# EAGLE design epoch_revA (EAGLE 9.5.2)

## Sheet 1 of 3
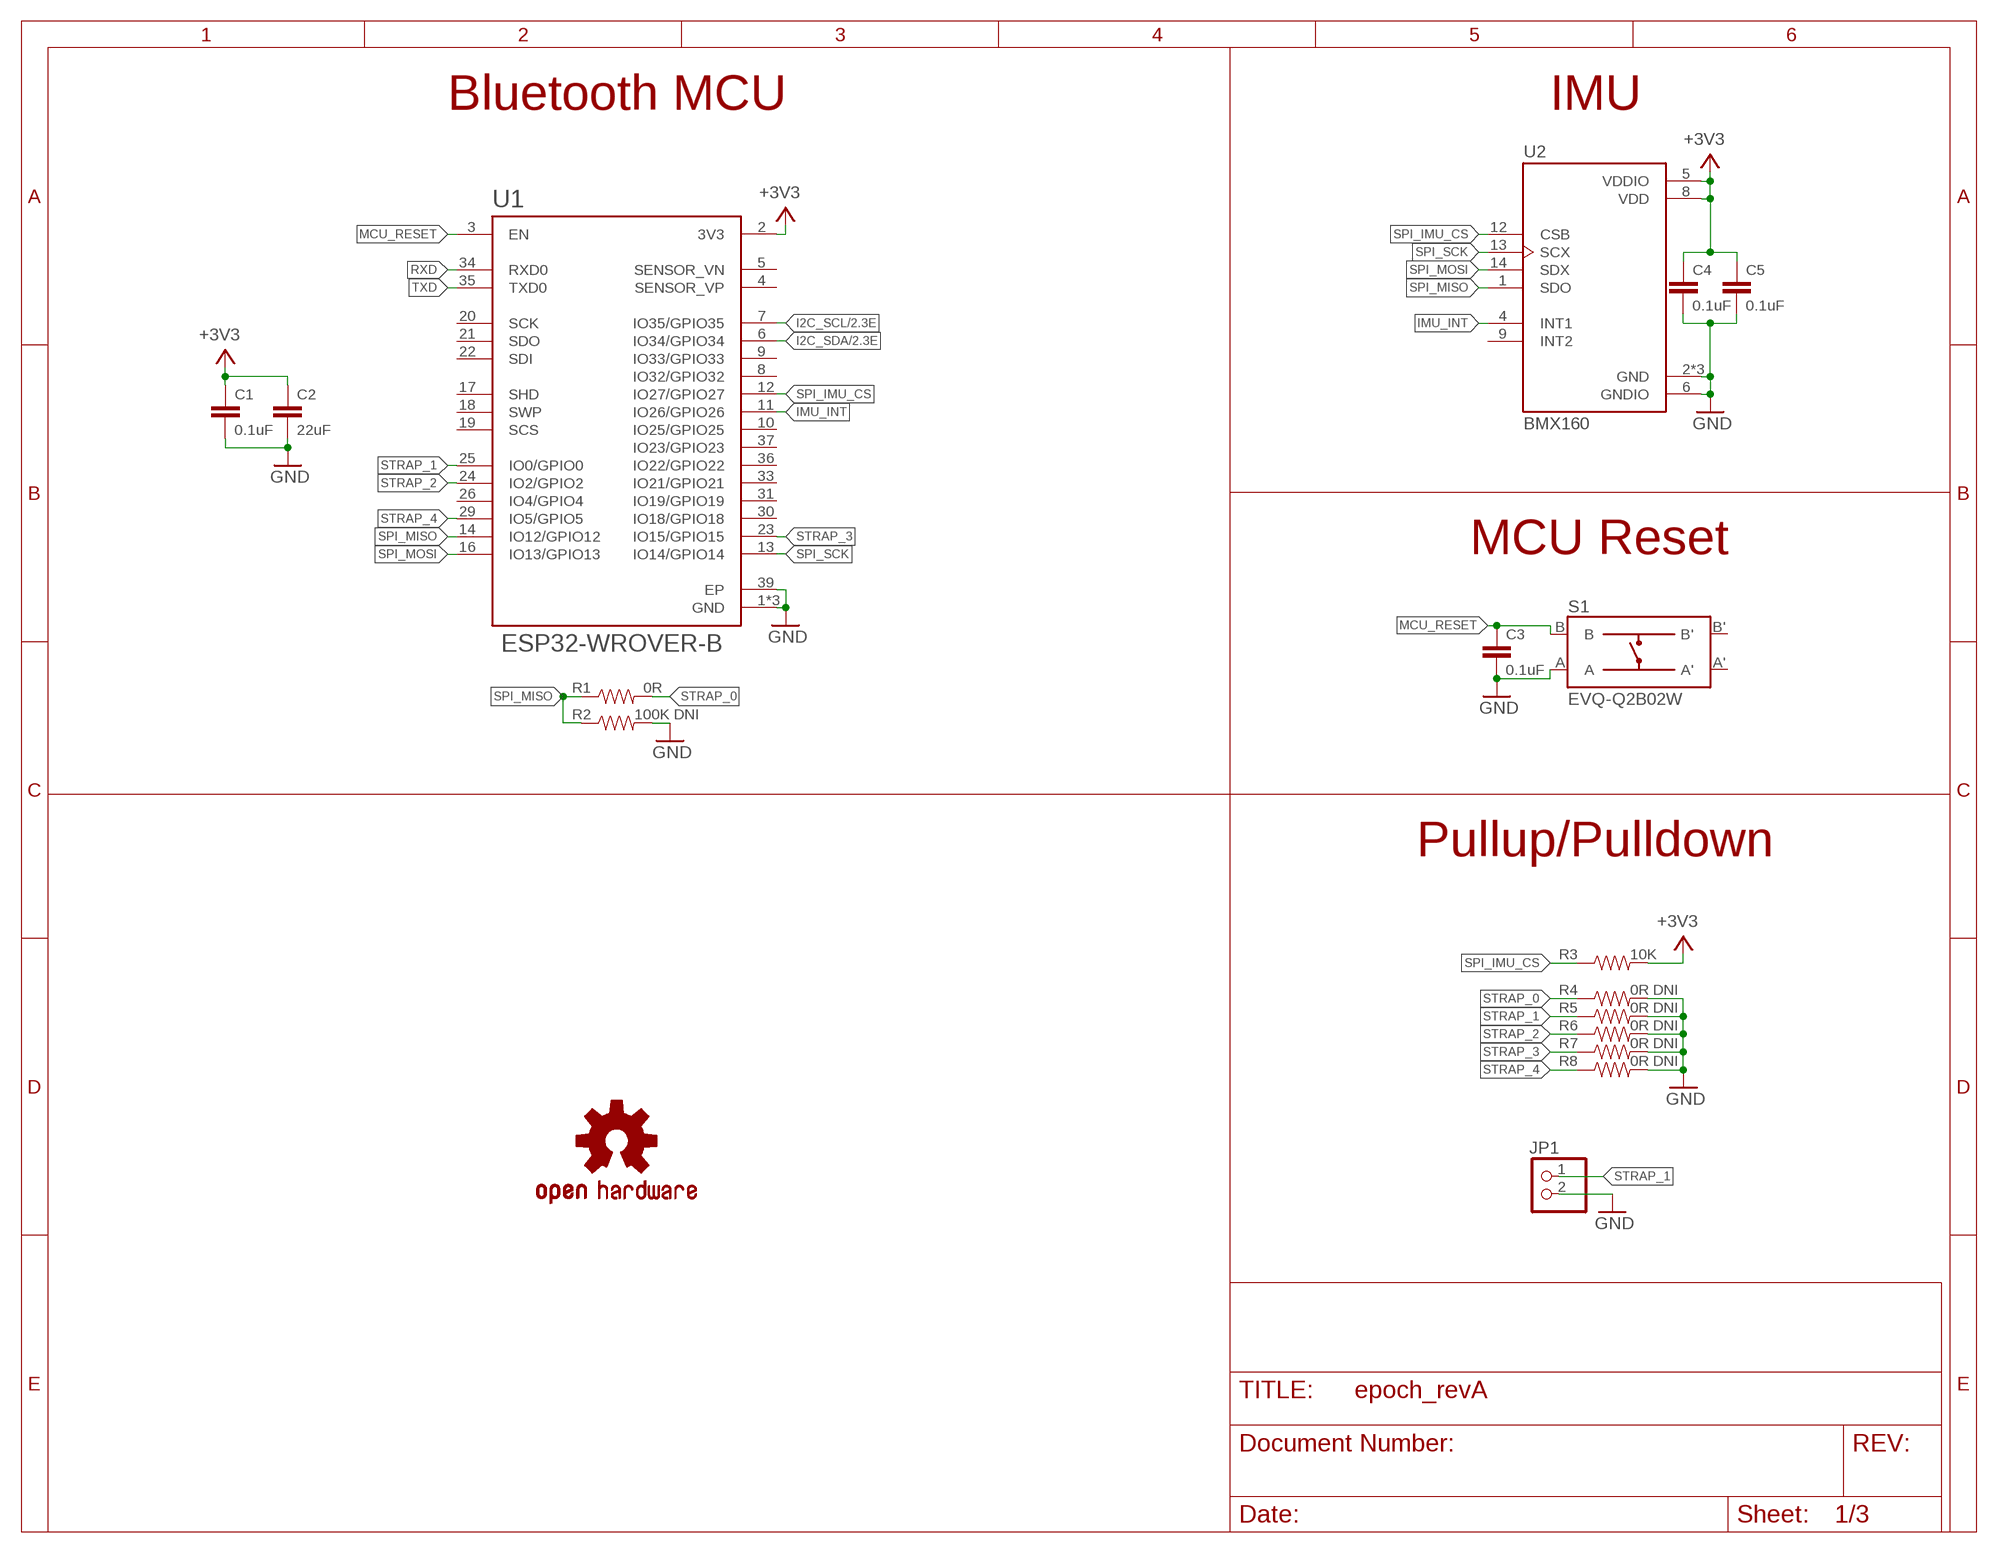
[diagram p0: schematic, sheet 1]

### Parts
C1  0.1uF  CAP_0603  [0603]
C2  22uF  CAP_0603  [0603]
C3  0.1uF  CAP_0603  [0603]
C4  0.1uF  CAP_0603  [0603]
C5  0.1uF  CAP_0603  [0603]
JP1  PINHD-1X2  [1X02]
LOGO1  OSHW-LOGOMINI  [OSHW-LOGO-MINI]
R1  0R  RES_0603  [0603]
R2  100K DNI  RES_0603  [0603]
R3  10K  RES_0603  [0603]
R4  0R DNI  RES_0603  [0603]
R5  0R DNI  RES_0603  [0603]
R6  0R DNI  RES_0603  [0603]
R7  0R DNI  RES_0603  [0603]
R8  0R DNI  RES_0603  [0603]
S1  EVQ-Q2B02W  [SW_EVQ-Q2B02W]
U1  ESP32-WROVER-B  ESP32-WROVER-B_(16MB)  [XCVR_ESP32-WROVER-B_(16MB)]
U2  BMX160  [PQFN50P250X300X100-14N]

### Nets
+3V3: C1.1 C2.1 C4.1 C5.1 R3.2 U1.2(3V3) U2.5(VDDIO) U2.8(VDD) ; also sheet 2,3
GND: C1.2 C2.2 C3.2 C4.2 C5.2 JP1.2 R2.2 R4.2 R5.2 R6.2 R7.2 R8.2 S1.A U1.1(GND) U1.15(GND) U1.38(GND) U1.39(EP) U2.2(GND) U2.3(GND) U2.6(GNDIO) U2.7(GND) ; also sheet 2,3
I2C_SCL: U1.7(IO35/GPIO35) ; also sheet 2
I2C_SDA: U1.6(IO34/GPIO34) ; also sheet 2
IMU_INT: U1.11(IO26/GPIO26) U2.4(INT1)
MCU_RESET: C3.1 S1.B U1.3(EN)
RXD: U1.34(RXD0)
SPI_IMU_CS: R3.1 U1.12(IO27/GPIO27) U2.12(CSB)
SPI_MISO: R1.1 R2.1 U1.14(IO12/GPIO12) U2.1(SDO)
SPI_MOSI: U1.16(IO13/GPIO13) U2.14(SDX)
SPI_SCK: U1.13(IO14/GPIO14) U2.13(SCX)
STRAP_0: R1.2 R4.1
STRAP_1: JP1.1 R5.1 U1.25(IO0/GPIO0)
STRAP_2: R6.1 U1.24(IO2/GPIO2)
STRAP_3: R7.1 U1.23(IO15/GPIO15)
STRAP_4: R8.1 U1.29(IO5/GPIO5)
TXD: U1.35(TXD0)
Unconnected: S1.A' S1.B' U1.4(SENSOR_VP) U1.5(SENSOR_VN) U1.8(IO32/GPIO32) U1.9(IO33/GPIO33) U1.10(IO25/GPIO25) U1.17(SHD) U1.18(SWP) U1.19(SCS) U1.20(SCK) U1.21(SDO) U1.22(SDI) U1.26(IO4/GPIO4) U1.30(IO18/GPIO18) U1.31(IO19/GPIO19) U1.33(IO21/GPIO21) U1.36(IO22/GPIO22) U1.37(IO23/GPIO23) U2.9(INT2)

### Notes on the sheet
- Bluetooth MCU | IMU
- MCU Reset
- Pullup/Pulldown

## Sheet 2 of 3
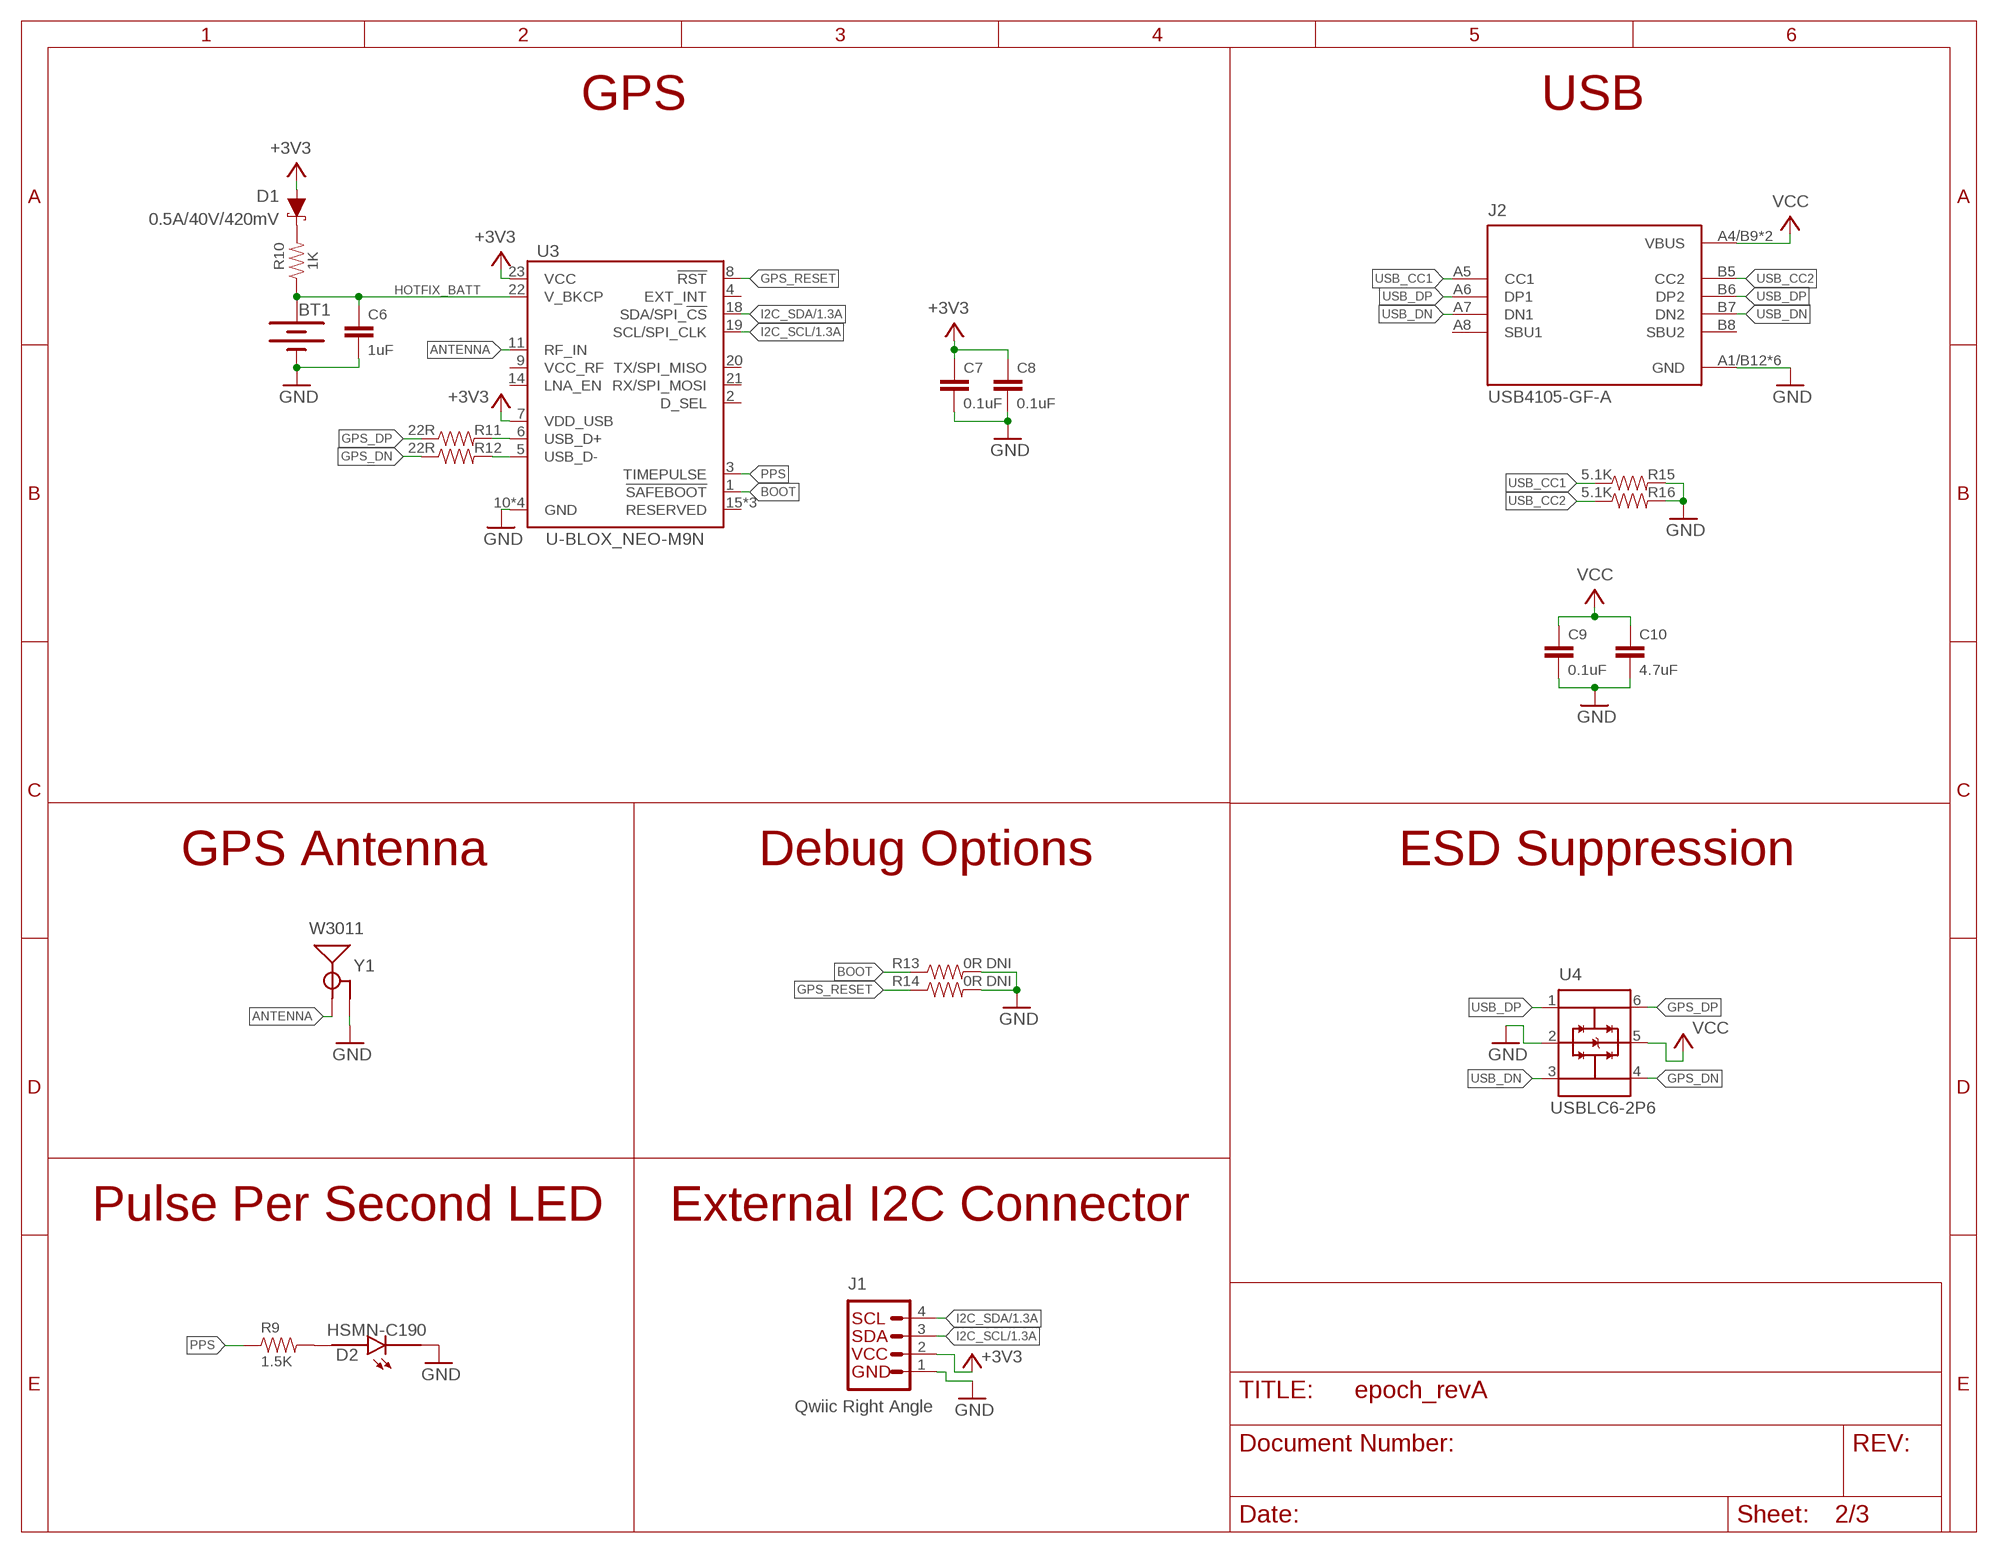
[diagram p1: schematic, sheet 2]

### Parts
BT1  ML414H-IV01E  ML414H_IV01E_BATTERY  [ML414H_IV01E]
C6  1uF  CAP_0603  [0603]
C7  0.1uF  CAP_0603  [0603]
C8  0.1uF  CAP_0603  [0603]
C9  0.1uF  CAP_0603  [0603]
C10  4.7uF  CAP_0603  [0603]
D1  0.5A/40V/420mV  DIODE-SCHOTTKY-PMEG4005EJ  [SOD-323]
D2  HSMN-C190  [LEDM1608X80]
J1  Qwiic Right Angle  I2C_STANDARDQWIIC  [1X04_1MM_RA]
J2  USB4105-GF-A  [GCT_USB4105-GF-A]
R9  1.5K  RES_0603  [0603]
R10  1K  RES_0603  [0603]
R11  22R  RES_0603  [0603]
R12  22R  RES_0603  [0603]
R13  0R DNI  RES_0603  [0603]
R14  0R DNI  RES_0603  [0603]
R15  5.1K  RES_0603  [0603]
R16  5.1K  RES_0603  [0603]
U3  U-BLOX_NEO-M9N  [NEO-M9N]
U4  USBLC6-2P6  [SOT50P160X60-6N]
Y1  W3011  GPS_CHIP_ANTENNAW3011  [W3011]

### Nets
+3V3: C7.1 C8.1 D1.A J1.2 U3.7(VDD_USB) U3.23(VCC) ; also sheet 1,3
ANTENNA: U3.11(RF_IN) Y1.1(SIGNAL)
BOOT: R13.1 U3.1(!SAFEBOOT!)
DN: R12.2 U3.5(USB_D-)
DP: R11.2 U3.6(USB_D+)
GND: BT1.- C6.2 C7.2 C8.2 C9.2 C10.2 D2.C J1.1 J2.A1/B12(GND) J2.B1/A12(GND) J2.G1(GND) J2.G2(GND) J2.G3(GND) J2.G4(GND) R13.2 R14.2 R15.2 R16.2 U3.10(GND) U3.12(GND) U3.13(GND) U3.24(GND) U4.2(GND) Y1.2(GND) Y1.3(GND) ; also sheet 1,3
GPS_DN: R12.1 U4.4(I/O2_2)
GPS_DP: R11.1 U4.6(I/O1_2)
GPS_RESET: R14.1 U3.8(!RST)
HOTFIX_BATT: BT1.+ C6.1 R10.1 U3.22(V_BKCP)
I2C_SCL: J1.3 U3.19(SCL/SPI_CLK) ; also sheet 1
I2C_SDA: J1.4 U3.18(SDA/SPI_!CS!) ; also sheet 1
N$1: D1.C R10.2
N$4: D2.A R9.2
PPS: R9.1 U3.3(TIMEPULSE)
USB_CC1: J2.A5(CC1) R15.1
USB_CC2: J2.B5(CC2) R16.1
USB_DN: J2.A7(DN1) J2.B7(DN2) U4.3(I/O2_1)
USB_DP: J2.A6(DP1) J2.B6(DP2) U4.1(I/O1_1)
VCC: C9.1 C10.1 J2.A4/B9(VBUS) J2.B4/A9(VBUS) U4.5(VBUS) ; also sheet 3
Unconnected: J2.A8(SBU1) J2.B8(SBU2) U3.2(D_SEL) U3.4(EXT_INT) U3.9(VCC_RF) U3.14(LNA_EN) U3.15(RESERVED) U3.16(RESERVED) U3.17(RESERVED) U3.20(TX/SPI_MISO) U3.21(RX/SPI_MOSI)

### Notes on the sheet
- GPS | USB
- GPS Antenna | Debug Options | ESD Suppression
- Pulse Per Second LED | External I2C Connector

## Sheet 3 of 3
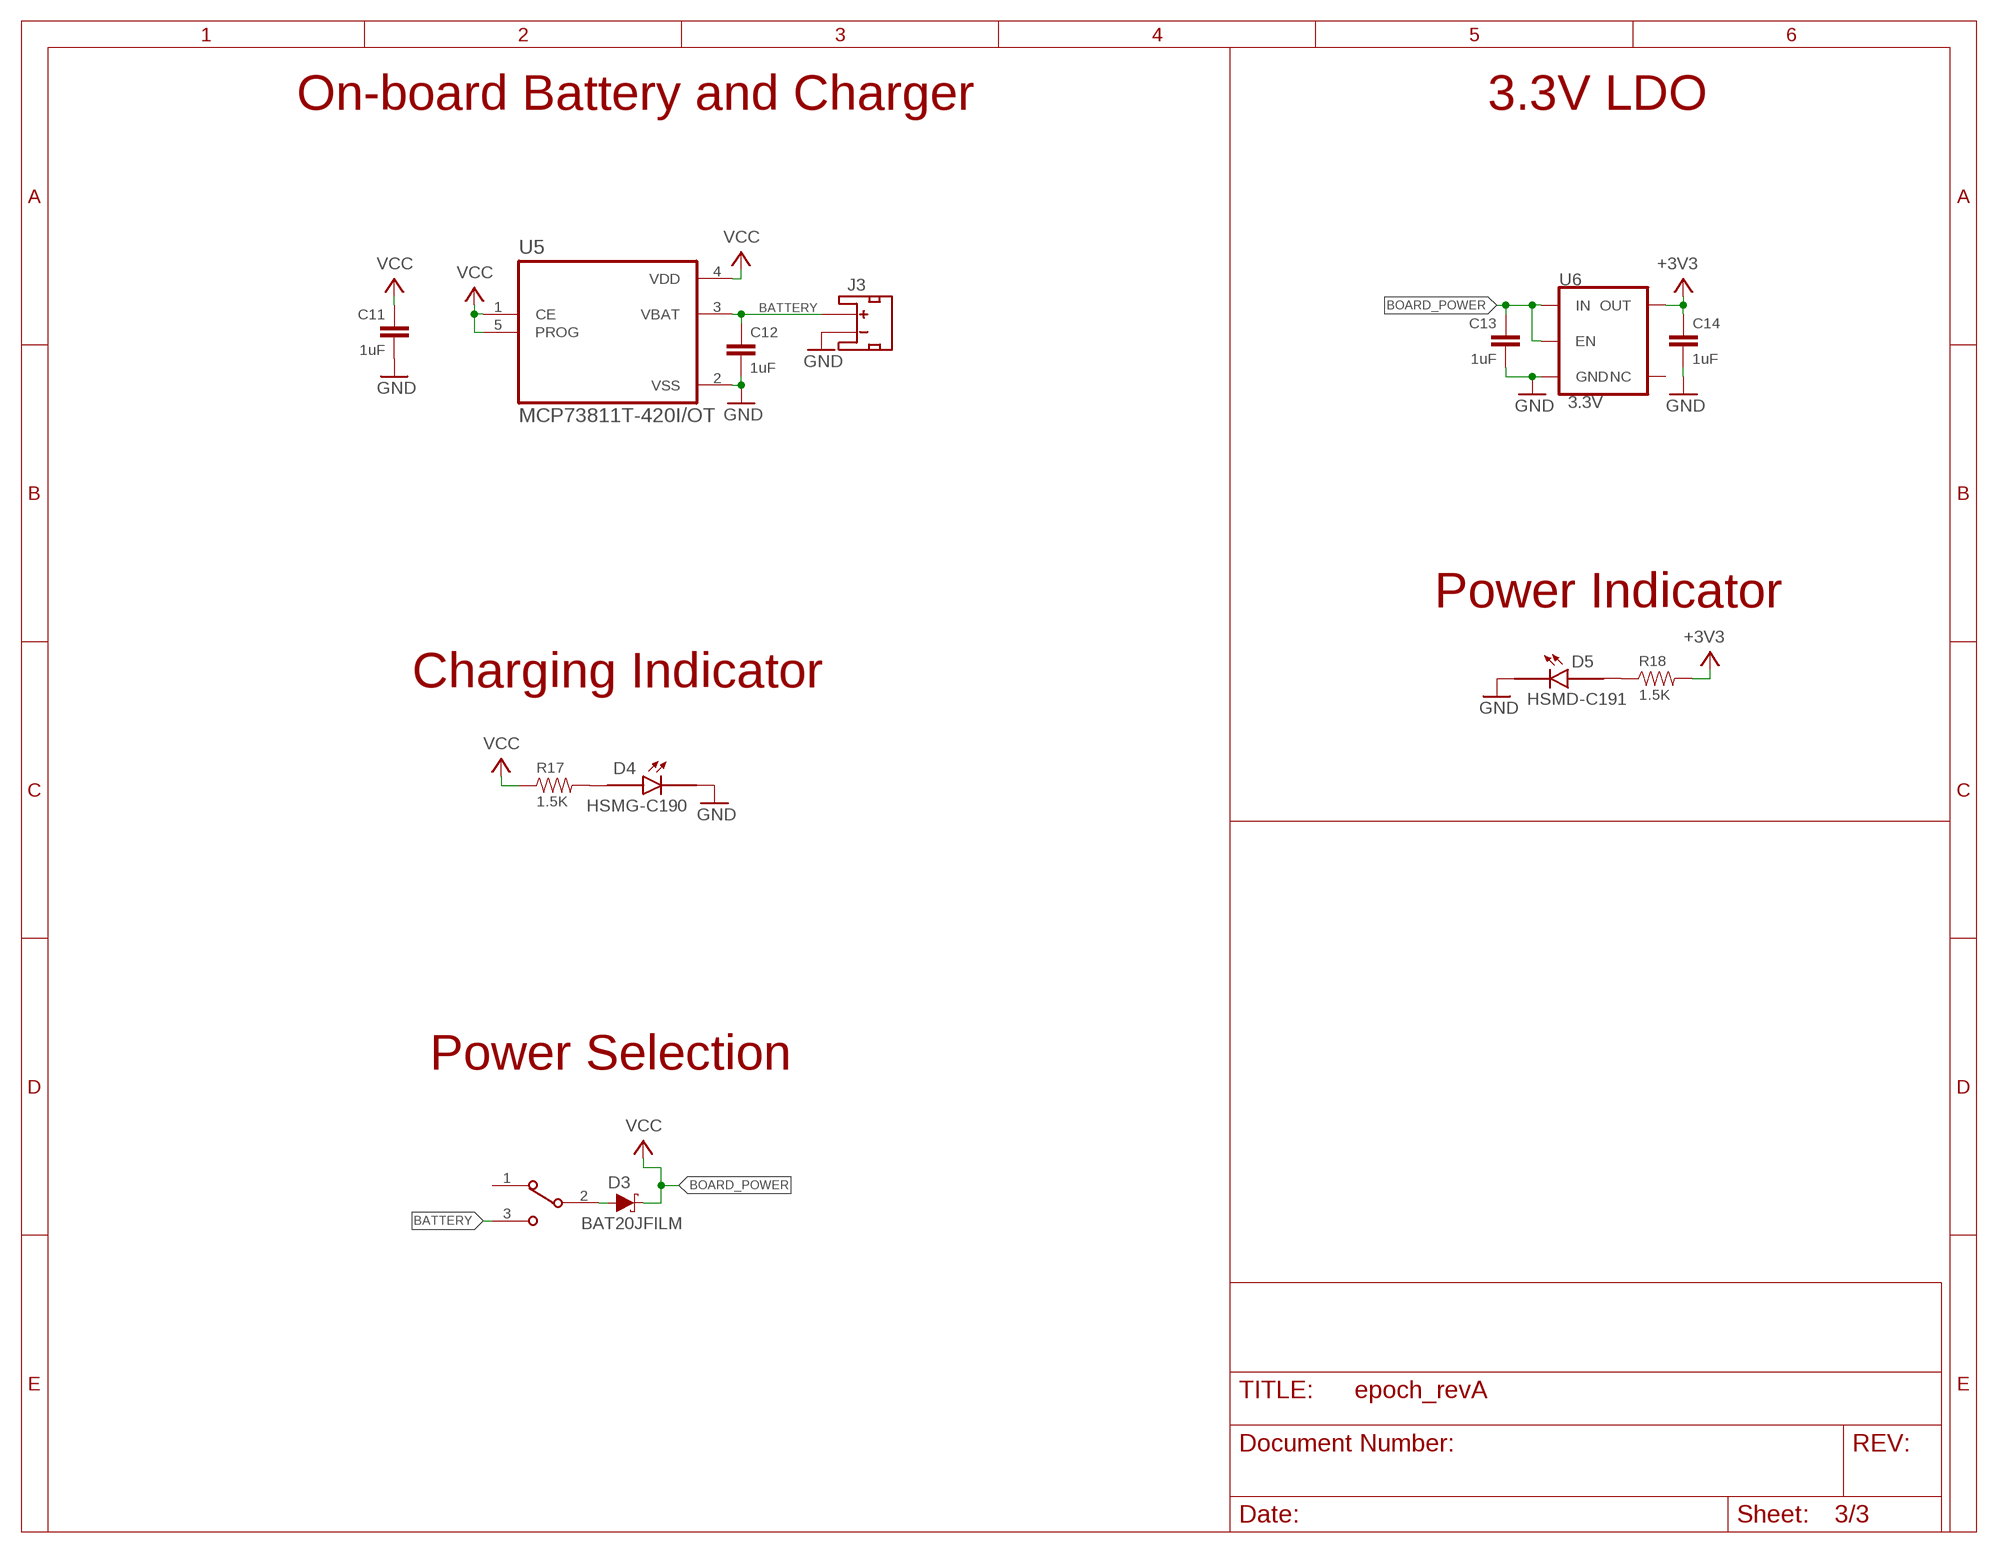
[diagram p2: schematic, sheet 3]

### Parts
C11  1uF  CAP_0603  [0603]
C12  1uF  CAP_0603  [0603]
C13  1uF  CAP_0603  [0603]
C14  1uF  CAP_0603  [0603]
D3  BAT20JFILM  DIODE-SCHOTTKY-BAT20J  [SOD-323]
D4  HSMG-C190  [LEDM1608X80]
D5  HSMD-C191  [LEDM1608X80]
J3  JST_2MM_MALE  [JST-2-SMD]
R17  1.5K  RES_0603  [0603]
R18  1.5K  RES_0603  [0603]
S2  EG1213  [SW_EG1213]
U5  MCP73811T-420I/OT  [SOT95P280X145-5N]
U6  3.3V  V_REG_AP2112K-3.3V  [SOT23-5]

### Nets
+3V3: C14.1 R18.2 U6.5(OUT) ; also sheet 1,2
BATTERY: C12.1 J3.2(+) S2.3 U5.3(VBAT)
BOARD_POWER: C13.1 D3.C U6.1(IN) U6.3(EN) ; supply symbol labelled VCC
GND: C11.2 C12.2 C13.2 C14.2 D4.C D5.C J3.1(-) U5.2(VSS) U6.2(GND) ; also sheet 1,2
N$5: D5.A R18.1
N$6: D4.A R17.2
N$7: D3.A S2.2
VCC: C11.1 R17.1 U5.1(CE) U5.4(VDD) U5.5(PROG) ; also sheet 2
Unconnected: J3.NC1(PAD1) J3.NC2(PAD2) S2.1 U6.4(NC)

### Notes on the sheet
- On-board Battery and Charger | 3.3V LDO
- Power Indicator
- Charging Indicator
- Power Selection

## Library data of the parts
BT1 = SparkFun-Batteries:ML414H_IV01E_BATTERY: SEIKO ML414H-IV01E Reflowable Lithium Battery ML414H is a rechargeable, coin type battery with features such as Pb-free reflowable (Peak temperature: 260 C) and high temperature heat resistance. Battery Characteristics: 3.1V max voltage Voff is 2V 1mAH 3k series resistor with battery 72 hour charge time from 2.0-3.1V 2.3-2.8V initial charge; PROD_ID: BATT-14267
C1-C14 = epoch:CAP_0603
D1 = SparkFun-DiscreteSemi:DIODE-SCHOTTKY: Schottky diode A Schottky diode is a semiconductor diode which has a low forward voltage drop and a very fast switching action.; PROD_ID: DIO-10955
D2 = epoch:HSMN-C190: LED; SMD; 0603; blue; 11.2-35mcd; 1.6x0.8x0.8mm; 170°; 3.3÷3.9V; AVAILABILITY: Unavailable; DESCRIPTION: LED; SMD; 0603; blue; 11.2-35mcd; 1.6x0.8x0.8mm; 170°; 3.3÷3.9V; MF: Broadcom Limited; MP: HSMN-C190; PACKAGE: 0603 Broadcom; PRICE: None
D3 = SparkFun-DiscreteSemi:DIODE-SCHOTTKY: Schottky diode A Schottky diode is a semiconductor diode which has a low forward voltage drop and a very fast switching action.; PROD_ID: DIO-11623; VALUE: 1A/23V/620mV
D4 = epoch:HSMG-C190: LED Uni-Color Green 570nm 2-Pin Chip LED T/R; AVAILABILITY: Unavailable; DESCRIPTION: LED; SMD; 0603; green; 4.5-15mcd; 1.6x0.8x0.8mm; 170°; 2.2÷2.6V; MF: Broadcom Limited; MP: HSMG-C190; PACKAGE: 0603 Broadcom; PRICE: None
D5 = epoch:HSMD-C191: LED Uni-Color Orange 605nm 2-Pin Chip LED T/R; AVAILABILITY: Unavailable; DESCRIPTION: LED Uni-Color Orange 605nm 2-Pin Chip LED T/R; MF: Broadcom Limited; MP: HSMD-C191; PACKAGE: 0603 Avago; PRICE: None
J1 = SparkFun-Connectors:I2C_STANDARD: SparkFun I2C Standard Pinout Header SparkFun has standardized on a pinout for all I2C based sensor breakouts. This pinout allows I2C boards to be plugged directly into the headers on Arduino Uno compatible boards, and to be daisy chained easily. Example SparkFun Products: SparkFun Atmospheric Sensor Breakout - BME280 <https://www.sparkfun.com/products/13676> SparkFun Altitude/Pressure Sensor Breakout - MPL3115A2 <https://www.sparkfun.com/products/11084> SparkFun TOF Range Finder Sensor - VL6180 <https://www.sparkfun.com/products/12785>; PROD_ID: CONN-13729
J2 = epoch:USB4105-GF-A: USB Type C Receptacle for USB 2.0 SMT Type, PCB Top Mount; AVAILABILITY: Unavailable; DESCRIPTION: USB - C _Type - C_ USB 2.0 Receptacle Connector 24 _16+8 Dummy_ Position Surface Mount, Right Angle; Through Hole; MF: GCT; MP: USB4105-GF-A; PACKAGE: None; PRICE: None
J3 = SparkFun-Connectors:JST_2MM_MALE: JST 2MM MALE RA CONNECTOR Two pin, compact surface mount connector. Commonly used as a battery input connection point. We really like the solid locking feeling and high current rating on these small connectors. We use these all the time as battery connectors. Mates to single-cell LiPo batteries. Here is the connector we sell at SparkFun: JST Right Angle Connector - White <https://www.sparkfun.com/products/8612> (PRT-08612) Datasheet <http://www.sparkfun.com/datasheets/Prototyping/Connectors/JST-Horizontal.pdf> It was used on these SparkFun products: SparkFun MOSFET Power Controller <https://www.sparkfun.com/products/11214> (PRT-11214) SparkFun Battery Babysitter - LiPo Battery Manager <https://www.sparkfun.com/products/13777> (PRT-13777) And many, many others that required a lipo battery connection.; PROD_ID: CONN-11443; SF_ID: PRT-08612
JP1 = DC_LOAD_AU:PINHD-1X2: PIN HEADER
LOGO1 = SparkFun-Aesthetics:OSHW-LOGO: Open-Source Hardware (OSHW) Logo This logo indicates the piece of hardware it is found on incorporates a OSHW license and/or adheres to the definition of open source hardware found here: http://freedomdefined.org/OSHW
R1-R18 = epoch:RES_0603
S1 = epoch:EVQ-Q2B02W: Switch Tactile N.O. SPST Round Button J-Bend 0.02A 15VDC 0.5N SMD Embossed T/R; AVAILABILITY: Unavailable; DESCRIPTION: Tactile Switch SPST-NO Top Actuated Surface Mount; MF: Panasonic; MP: EVQ-Q2B02W; PACKAGE: None; PRICE: None
S2 = epoch:EG1213: EG Series SPDT On-On Right Angle Through Hole Slide Switch; AVAILABILITY: Unavailable; DESCRIPTION: Slide Switch SPDT Through Hole, Right Angle; MF: E-Switch; MP: EG1213; PACKAGE: None; PRICE: None
U1 = epoch:ESP32-WROVER-B_(16MB): WiFi SMD Module, ESP32-WROVER-B, 16MB Flash memory; AVAILABILITY: Unavailable; DESCRIPTION: Generic WiFi-BT-BLE MCU module. Flash memory of 16 MB and PSRAM of 8 MB; MF: Espressif Systems; MP: ESP32-WROVER-B _16MB_; PACKAGE: None; PRICE: None
U2 = epoch:BMX160: IMU ACCEL/GYRO/MAG; AVAILABILITY: Unavailable; DESCRIPTION: Accelerometer, Gyroscope, Magnetometer, 9 Axis Sensor I²C, SPI Output; MF: Bosch Sensortec; MP: BMX160; PACKAGE: VFLGA-14 Bosch Sensortec; PRICE: None
U3 = gps:U-BLOX_NEO-M9N: u-blox NEO-M9N GPS Module The NEO-M9N module is built on the robust u-blox M9 GNSS chip, which provides exceptional sensitivity and acquisition times for all L1 GNSS systems. The u-blox M9 standard precision GNSS platform, which delivers meter-level accuracy, succeeds the well-known u-blox M8 product range. The receiver also provides higher navigation rate and improved security features compared to previous u-blox GNSS generations. The NEO-M9N module is available in the NEO form factor LLC package; PROD_ID: IC-14651
U4 = epoch:USBLC6-2P6: The USBLC6-2SC6 and USBLC6-2P6 are monolithic application specific devices dedicated to ESD protection of high speed interfaces, such as USB 2.0, Ethernet links and video lines. The very low line capacitance secures a high level of signal integrity without compromising in protecting sensitive chips against the most stringently characterized ESD strikes; AVAILABILITY: Unavailable; DESCRIPTION: USBLC6 Series 2 Line 6 V SMT Bi Directional ESD Protection - SOT-666; MF: STMicroelectronics; MP: USBLC6-2P6; PACKAGE: SOT-563 STMicroelectronics; PRICE: None
U5 = epoch:MCP73811T-420I/OT; AVAILABILITY: Unavailable; DESCRIPTION: Charger IC Lithium Ion/Polymer SOT-23-5; MF: Microchip; MP: MCP73811T-420I/OT; PACKAGE: SOT-23 Microchip; PRICE: None
U6 = SparkFun-IC-Power:V_REG_AP2112: AP2112 - 600mA CMOS LDO Regulator w/ Enable The AP2112 is CMOS process low dropout linear regulator with enable function, the regulator delivers a guaranteed 600mA (min.) continuous load current. Features Output Voltage Accuracy: ±1.5% Output Current: 600mA (Min.) Foldback Short Current Protection: 50mA Enable Function to Turn ON/OFF VOUT Low Dropout Voltage (3.3V): 250mV (Typ.) @IOUT=600mA Excellent Load Regulation: 0.2%/A (Typ.) Excellent Line Regulation: 0.02%/V (Typ.) Low Quiescent Current: 55μA (Typ.) Low Standby Current: 0.01μA (Typ.) Low Output Noise: 50μVRMS PSRR: 100Hz -65dB, 1kHz -65dB OTSD Protection Stable with 1.0μF Flexible Cap: Ceramic, Tantalum and Aluminum Electrolytic Operation Temperature Range: -40°C to 85°C ESD: MM 400V, HBM 4000V; PROD_ID: VREG-12457
Y1 = SparkFun-GPS:GPS_CHIP_ANTENNA; PROD_ID: ANT-14304

## Net classes
1 Diff_pair: width 0.254 mm, drill 0.102 mm, clearance 0.152 mm
2 3.3V: width 0.508 mm
3 Antenna: width 1 mm, clearance 0.3 mm

## Board
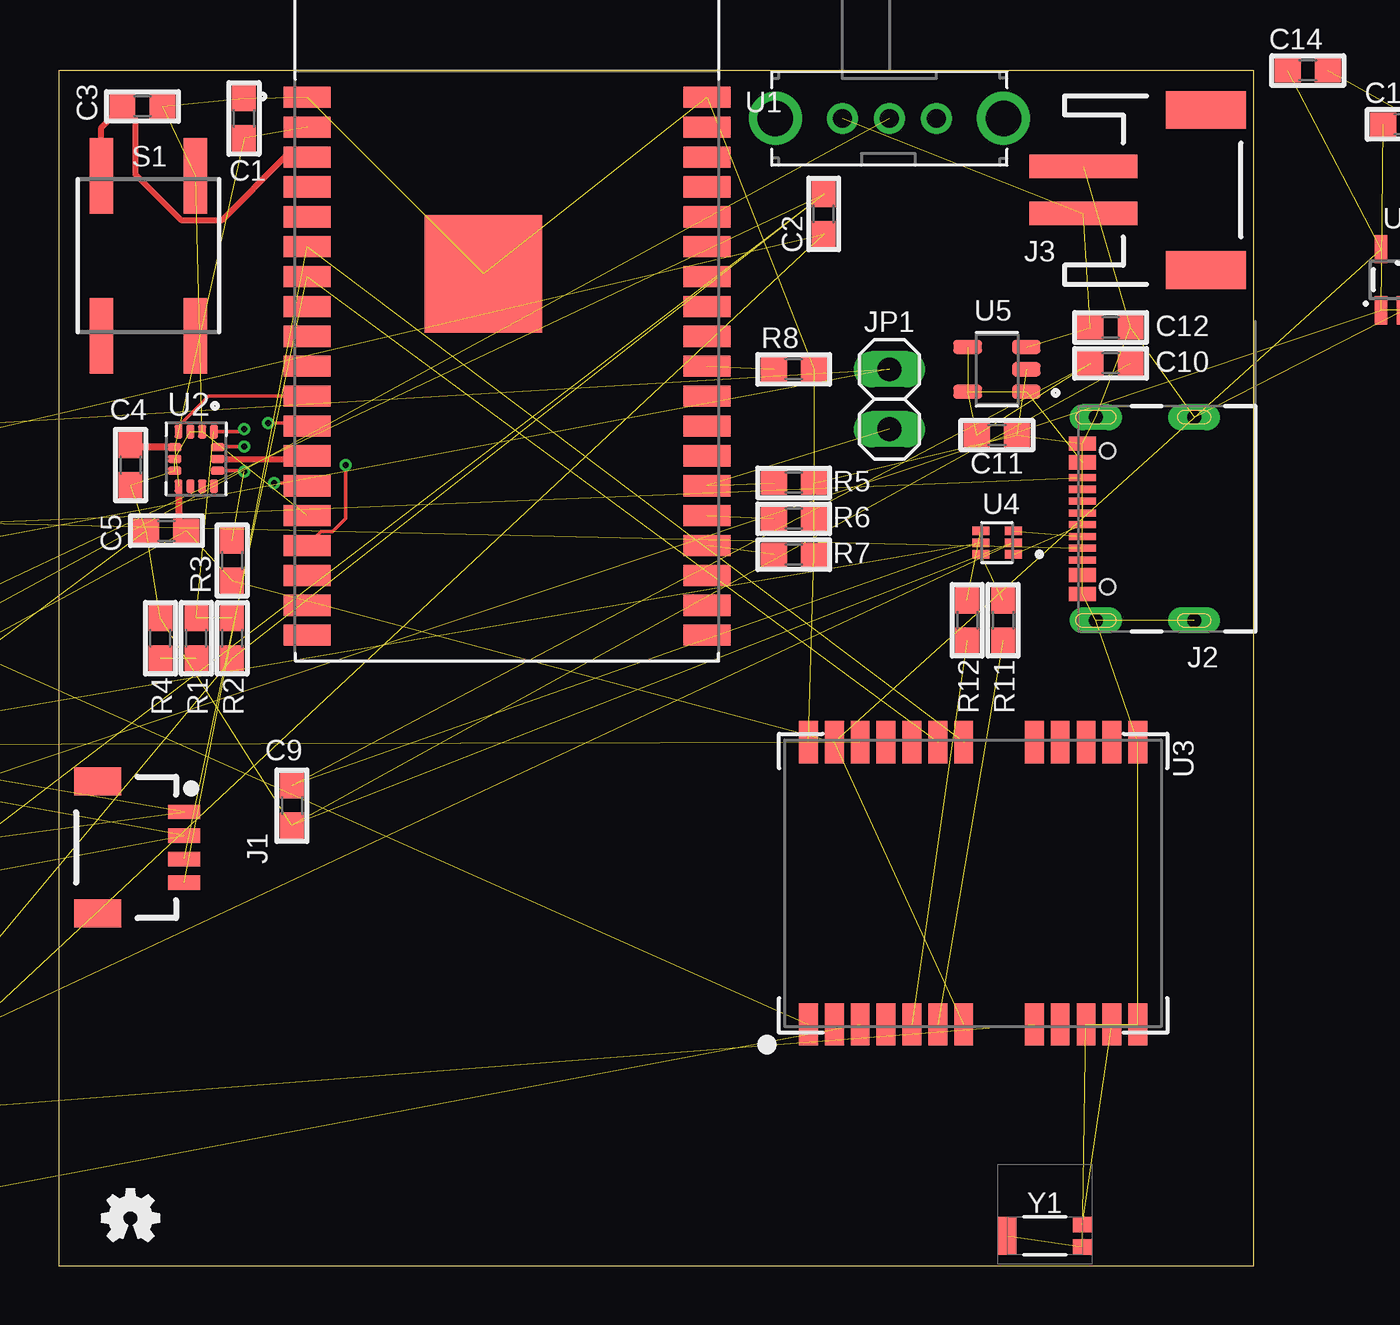
[diagram p3: board, top side]
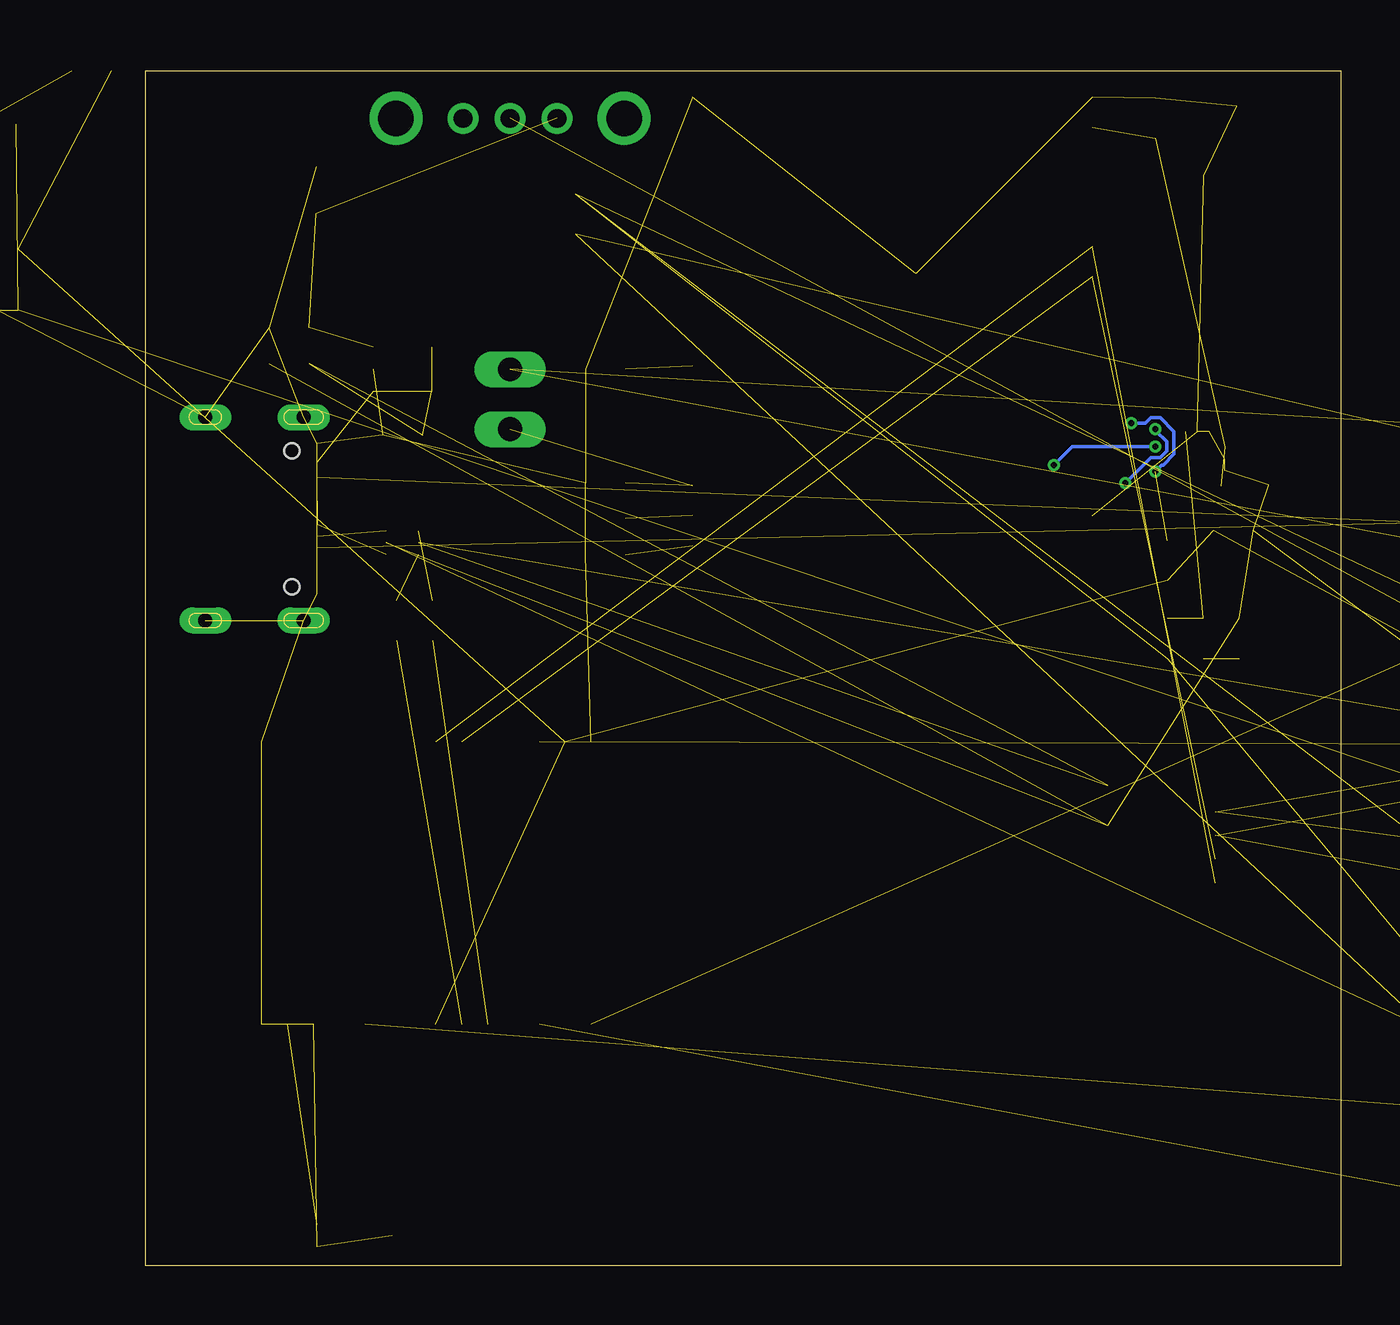
[diagram p4: board, bottom side, seen from below]

Size 50.8 x 50.8 mm. Coordinates in mm from the lower left corner, seen from the top.
Outline: 0,0 50.8,0 50.8,50.8 0,50.8 0,0
Copper layers (1*16): Top 0.035mm / dielectric 1.5mm / Bottom 0.035mm
Design rules "default *": minimum track width 6mil, minimum drill 10mil, track to track 6mil, track to pad 6mil, pad to pad 6mil, via to via 6mil, smd to smd 6mil, copper to edge 40mil, drill to drill 6mil, minimum pad ring 10mil, minimum via ring 5mil, stop-mask expansion 4mil, vias tented up to drill 0mil, thermal gap 10mil

### Footprints (pad centres in the part's own frame; a part is rotated, then mirrored left to right if it is on the bottom)
ML414H_IV01E = smd 1 x 1: + 2.022,2.032 | smd 4.2 x 1.7: - 0.6,-1.85
0603 = smd 1.1 x 1: 1 -0.85,0; 2 0.85,0
SOD-323 = smd 0.63 x 0.83: A 1.15,0; C -1.15,0
LEDM1608X80 = smd 0.8 x 0.8: A 0.75,0; C -0.75,0
1X04_1MM_RA = smd 0.6 x 1.35: 1 -1.5,0; 2 -0.5,0; 3 0.5,0; 4 1.5,0 | smd 1.2 x 2: NC1 2.8,-3.675; NC2 -2.8,-3.675
GCT_USB4105-GF-A = smd 0.6 x 1.15: A1/B12 -3.2,4.755; A4/B9 -2.4,4.755; B1/A12 3.2,4.755; B4/A9 2.4,4.755 | smd 0.3 x 1.15: A5 -1.25,4.755; A6 -0.25,4.755; A7 0.25,4.755; A8 1.25,4.755; B5 1.75,4.755; B6 0.75,4.755; B7 -0.75,4.755; B8 -1.75,4.755 | drill 0.6 pad 1 long: G1 -4.32,0; G2 4.32,0 | drill 0.6 pad 1.05 long: G3 -4.32,4.18; G4 4.32,4.18 | hole 0.65: 2.89,3.68; -2.89,3.68
JST-2-SMD = smd 1 x 4.6: 1 -1,-3.7; 2 1,-3.7 | smd 1.6 x 3.4: NC1 -3.4,1.5; NC2 3.4,1.5
1X02 = drill 1.016 long: 1 -1.27,0; 2 1.27,0
SW_EVQ-Q2B02W = smd 3.2 x 1: A 3.4,-2; A' -3.4,-2; B 3.4,2; B' -3.4,2
SW_EG1213 = drill 0.8: 1 -2,0; 2 0,0; 3 2,0 | drill 1.5: P$4 -4.85,0; P$5 4.85,0
XCVR_ESP32-WROVER-B_(16MB) = smd 2 x 0.9: 1 -8.5,8.26; 2 -8.5,6.99; 3 -8.5,5.72; 4 -8.5,4.45; 5 -8.5,3.18; 6 -8.5,1.91; 7 -8.5,0.64; 8 -8.5,-0.63; 9 -8.5,-1.9; 10 -8.5,-3.17; 11 -8.5,-4.44; 12 -8.5,-5.71; 13 -8.5,-6.98; 14 -8.5,-8.25; 15 -8.5,-9.52; 16 -8.5,-10.79; 17 -8.5,-12.06; 18 -8.5,-13.33; 19 -8.5,-14.6; 20 8.5,-14.6; 21 8.5,-13.33; 22 8.5,-12.06; 23 8.5,-10.79; 24 8.5,-9.52; 25 8.5,-8.25; 26 8.5,-6.98; 27 8.5,-5.71; 28 8.5,-4.44; 29 8.5,-3.17; 30 8.5,-1.9; 31 8.5,-0.63; 32 8.5,0.64; 33 8.5,1.91; 34 8.5,3.18; 35 8.5,4.45; 36 8.5,5.72; 37 8.5,6.99; 38 8.5,8.26 | smd 5 x 5: 39 -1,0.76
PQFN50P250X300X100-14N = smd 0.58 x 0.35: 1 -1.16,0.75; 2 -1.16,0.25; 3 -1.16,-0.25; 4 -1.16,-0.75; 8 1.16,-0.75; 9 1.16,-0.25; 10 1.16,0.25; 11 1.16,0.75 | smd 0.35 x 0.58: 5 -0.5,-0.91; 6 0,-0.91; 7 0.5,-0.91; 12 0.5,0.91; 13 0,0.91; 14 -0.5,0.91
NEO-M9N = smd 1.8 x 0.8: 1 6,-7; 2 6,-5.9; 3 6,-4.8; 4 6,-3.7; 5 6,-2.6; 6 6,-1.5; 7 6,-0.4; 8 6,2.6; 9 6,3.7; 10 6,4.8; 11 6,5.9; 12 6,7; 13 -6,7; 14 -6,5.9; 15 -6,4.8; 16 -6,3.7; 17 -6,2.6; 18 -6,-0.4; 19 -6,-1.5; 20 -6,-2.6; 21 -6,-3.7; 22 -6,-4.8; 23 -6,-5.9; 24 -6,-7
SOT50P160X60-6N = smd 0.75 x 0.35: 1 -0.69,0.5; 2 -0.69,0; 3 -0.69,-0.5; 4 0.69,-0.5; 5 0.69,0; 6 0.69,0.5
SOT95P280X145-5N = smd 1.22 x 0.6: 1 -1.245,0.95; 2 -1.245,0; 3 -1.245,-0.95; 4 1.245,-0.95; 5 1.245,0.95
SOT23-5 = smd 0.55 x 1.2: 1 -0.95,-1.3; 2 0,-1.3; 3 0.95,-1.3; 4 0.95,1.3; 5 -0.95,1.3
W3011 = smd 0.8 x 0.65: 1 1.6,0.475; 2 1.6,-0.475 | smd 0.8 x 1.6: 3 -1.6,0

### Placement (x,y rotation side)
BT1  -54.36,13.21 0 top  (outside the outline)
C1  7.87,48.77 90 top
C2  32.51,44.7 90 top
C3  3.56,49.28 0 top
C4  3.05,34.04 270 top
C5  4.57,31.24 180 top
C6  -33.02,25.4 0 top  (outside the outline)
C7  -6.35,8.38 180 top  (outside the outline)
C8  -6.35,24.38 0 top  (outside the outline)
C9  9.91,19.56 270 top
C10  44.7,38.35 0 top
C11  39.88,35.31 0 top
C12  44.7,39.88 0 top
C13  57.15,48.51 0 top  (outside the outline)
C14  53.09,50.8 0 top
D1  -53.09,7.62 0 top  (outside the outline)
D2  -33.02,-5.08 0 top  (outside the outline)
D3  -41.91,7.37 0 top  (outside the outline)
D4  -33.02,14.22 0 top  (outside the outline)
D5  -33.02,17.27 0 top  (outside the outline)
J1  5.33,17.78 270 top
J2  48.26,31.75 90 top
J3  47.24,45.72 270 top
JP1  35.31,36.83 90 top
LOGO1  3.05,2.03 0 top
R1  5.84,26.67 270 top
R2  7.37,26.67 270 top
R3  7.37,29.97 270 top
R4  4.32,26.67 90 top
R5  31.24,33.27 0 top
R6  31.24,31.75 0 top
R7  31.24,30.23 0 top
R8  31.24,38.1 0 top
R9  -33.02,-2.54 0 top  (outside the outline)
R10  -33.02,22.1 0 top  (outside the outline)
R11  40.13,27.43 270 top
R12  38.61,27.43 270 top
R13  -17.78,32.77 0 top  (outside the outline)
R14  -6.35,6.6 180 top  (outside the outline)
R15  -54.86,32.77 0 top  (outside the outline)
R16  -54.86,29.46 0 top  (outside the outline)
R17  -41.66,16.76 0 top  (outside the outline)
R18  -41.66,26.67 0 top  (outside the outline)
S1  3.81,42.93 90 top
S2  35.31,48.77 180 top
U1  19.05,41.4 0 top
U2  5.84,34.29 270 top
U3  38.86,16.26 270 top
U4  39.88,30.73 180 top
U5  39.88,38.1 180 top
U6  57.15,41.91 0 top  (outside the outline)
Y1  41.91,1.27 0 top

### Tracks (layer width: path | path; a pad name or v marks a point on that pad's centre or on a via)
+3V3  (14 unrouted)
  Top 0.305: U2.8 5.09,31.57 C5.1 | U2.5 3.14,34.79 C4.1
ANTENNA  (1 unrouted)
BATTERY  (3 unrouted)
BOARD_POWER  (3 unrouted)
BOOT  (1 unrouted)
DN  (1 unrouted)
DP  (1 unrouted)
GND  (54 unrouted)
GPS_DN  (1 unrouted)
GPS_DP  (1 unrouted)
GPS_RESET  (1 unrouted)
HOTFIX_BATT  (3 unrouted)
I2C_SCL  (2 unrouted)
I2C_SDA  (2 unrouted)
IMU_INT
  Top 0.152: U2.4 5.19,35.55 5.19,35.78 6.37,36.96 U1.11
MCU_RESET
  Top 0.254: S1.B 1.81,48.38 C3.1 3.25,48.73 3.25,46.39 5.19,44.45 6.93,44.45 9.61,47.12 U1.3
N$1  (1 unrouted)
N$4  (1 unrouted)
N$5  (1 unrouted)
N$6  (1 unrouted)
N$7  (1 unrouted)
PPS  (1 unrouted)
SPI_IMU_CS  (via drill 0.25)  (1 unrouted)
  Top 0.152: U2.12 7.84,33.79 v7.87,33.76 | v8.89,35.81 10.43,35.81 U1.12
  Bottom 0.152: v7.87,33.76 7.59,34.04 7.55,34.04 7.09,34.5 7.09,35.45 7.67,36.04 8.07,36.04 8.3,35.81 v8.89,35.81
SPI_MISO  (via drill 0.25)  (2 unrouted)
  Top 0.152: U2.1 7.76,35.45 v7.87,35.56 | v9.14,33.27 10.43,33.27 U1.14
  Bottom 0.152: v9.14,33.27 8.08,34.34 7.67,34.34 7.39,34.62 7.39,35.02 7.87,35.51 v7.87,35.56
SPI_MOSI  (via drill 0.25)
  Top 0.152: U2.14 6.79,34.82 v7.87,34.82 | U1.16 11.14,31.2 11.64,31.2 12.19,31.75 v12.19,34.04
  Bottom 0.152: v7.87,34.82 11.4,34.82 v12.19,34.04
SPI_SCK
  Top 0.254: U2.13 10.42,34.29 U1.13
STRAP_0  (1 unrouted)
STRAP_1  (2 unrouted)
STRAP_2  (1 unrouted)
STRAP_3  (1 unrouted)
STRAP_4  (1 unrouted)
USB_CC1  (1 unrouted)
USB_CC2  (1 unrouted)
USB_DN  (2 unrouted)
USB_DP  (2 unrouted)
VCC  (9 unrouted)